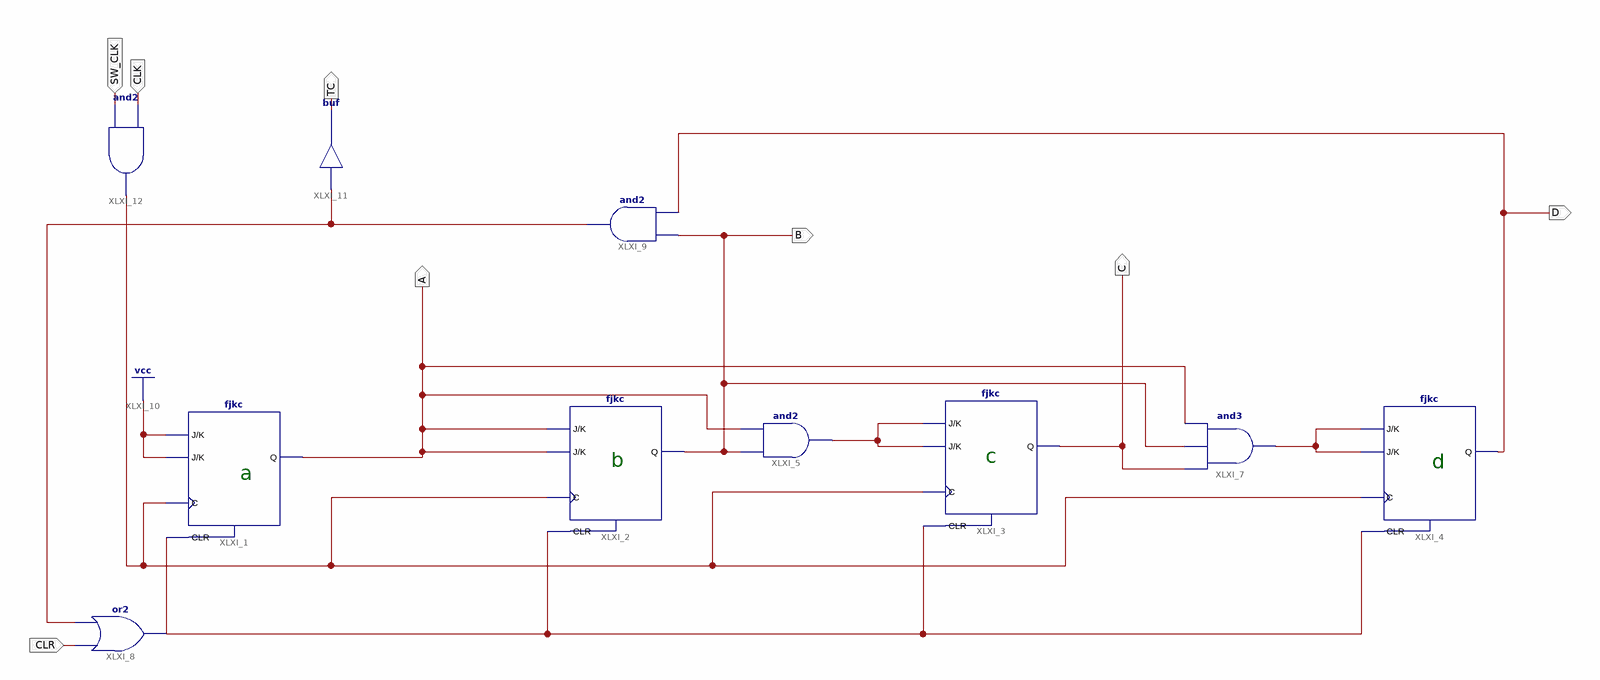
[diagram p0: schematic sheet 1]
// Xilinx ISE schematic NUM_0_9_CLK_SW_CLR.sch (spartan6) as structural Verilog: 10 symbols, 8 ports
module NUM_0_9_CLK_SW_CLR (
  input  CLK,
  input  SW_CLK,
  input  CLR,
  output B,
  output C,
  output A,
  output D,
  output TC
);

  wire XLXN_1, XLXN_3, XLXN_10, XLXN_14, XLXN_19;

  fjkc XLXI_1 (.C(XLXN_1), .CLR(XLXN_3), .J(1'b1), .K(1'b1), .Q(A));
  fjkc XLXI_2 (.C(XLXN_1), .CLR(XLXN_3), .J(A), .K(A), .Q(B));
  fjkc XLXI_3 (.C(XLXN_1), .CLR(XLXN_3), .J(XLXN_10), .K(XLXN_10), .Q(C));
  fjkc XLXI_4 (.C(XLXN_1), .CLR(XLXN_3), .J(XLXN_14), .K(XLXN_14), .Q(D));
  and XLXI_5 (XLXN_10, B, A);
  and XLXI_7 (XLXN_14, C, B, A);
  or XLXI_8 (XLXN_3, CLR, XLXN_19);
  and XLXI_9 (XLXN_19, D, B);
  buf XLXI_11 (TC, XLXN_19);
  and XLXI_12 (XLXN_1, SW_CLK, CLK);

  // Notes on the sheet:
  //   c
  //   b
  //   d
  //   a
endmodule
